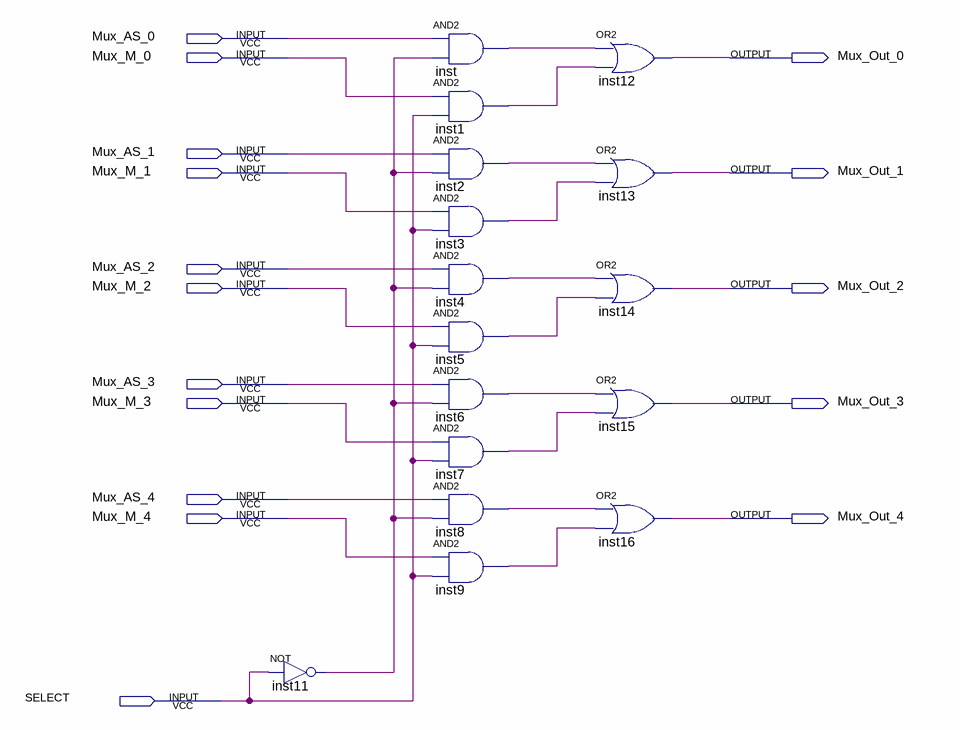
[diagram p0: schematic sheet]
// Quartus schematic Mux10a5.bdf as structural Verilog: 16 symbols, 16 pins
module Mux10a5 (
  input  Mux_AS_0,
  input  Mux_M_0,
  input  Mux_AS_1,
  input  Mux_M_1,
  input  Mux_AS_2,
  input  Mux_M_2,
  input  Mux_AS_3,
  input  Mux_M_3,
  input  Mux_AS_4,
  input  Mux_M_4,
  input  SELECT,
  output Mux_Out_0,
  output Mux_Out_1,
  output Mux_Out_2,
  output Mux_Out_3,
  output Mux_Out_4
);

  wire inst1_out, inst2_out, inst3_out, inst4_out, inst5_out, inst6_out, inst7_out, inst8_out, inst9_out,
       inst11_out, inst_out;

  not inst11 (inst11_out, SELECT);
  and inst (inst_out, Mux_AS_0, inst11_out);
  and inst1 (inst1_out, Mux_M_0, SELECT);
  and inst2 (inst2_out, Mux_AS_1, inst11_out);
  and inst3 (inst3_out, Mux_M_1, SELECT);
  and inst4 (inst4_out, Mux_AS_2, inst11_out);
  and inst5 (inst5_out, Mux_M_2, SELECT);
  and inst6 (inst6_out, Mux_AS_3, inst11_out);
  and inst7 (inst7_out, Mux_M_3, SELECT);
  and inst8 (inst8_out, Mux_AS_4, inst11_out);
  and inst9 (inst9_out, Mux_M_4, SELECT);
  or inst12 (Mux_Out_0, inst_out, inst1_out);
  or inst13 (Mux_Out_1, inst2_out, inst3_out);
  or inst14 (Mux_Out_2, inst4_out, inst5_out);
  or inst15 (Mux_Out_3, inst6_out, inst7_out);
  or inst16 (Mux_Out_4, inst8_out, inst9_out);
endmodule
